# Altium schematic sheet 底板20160428.SchDoc
size A1
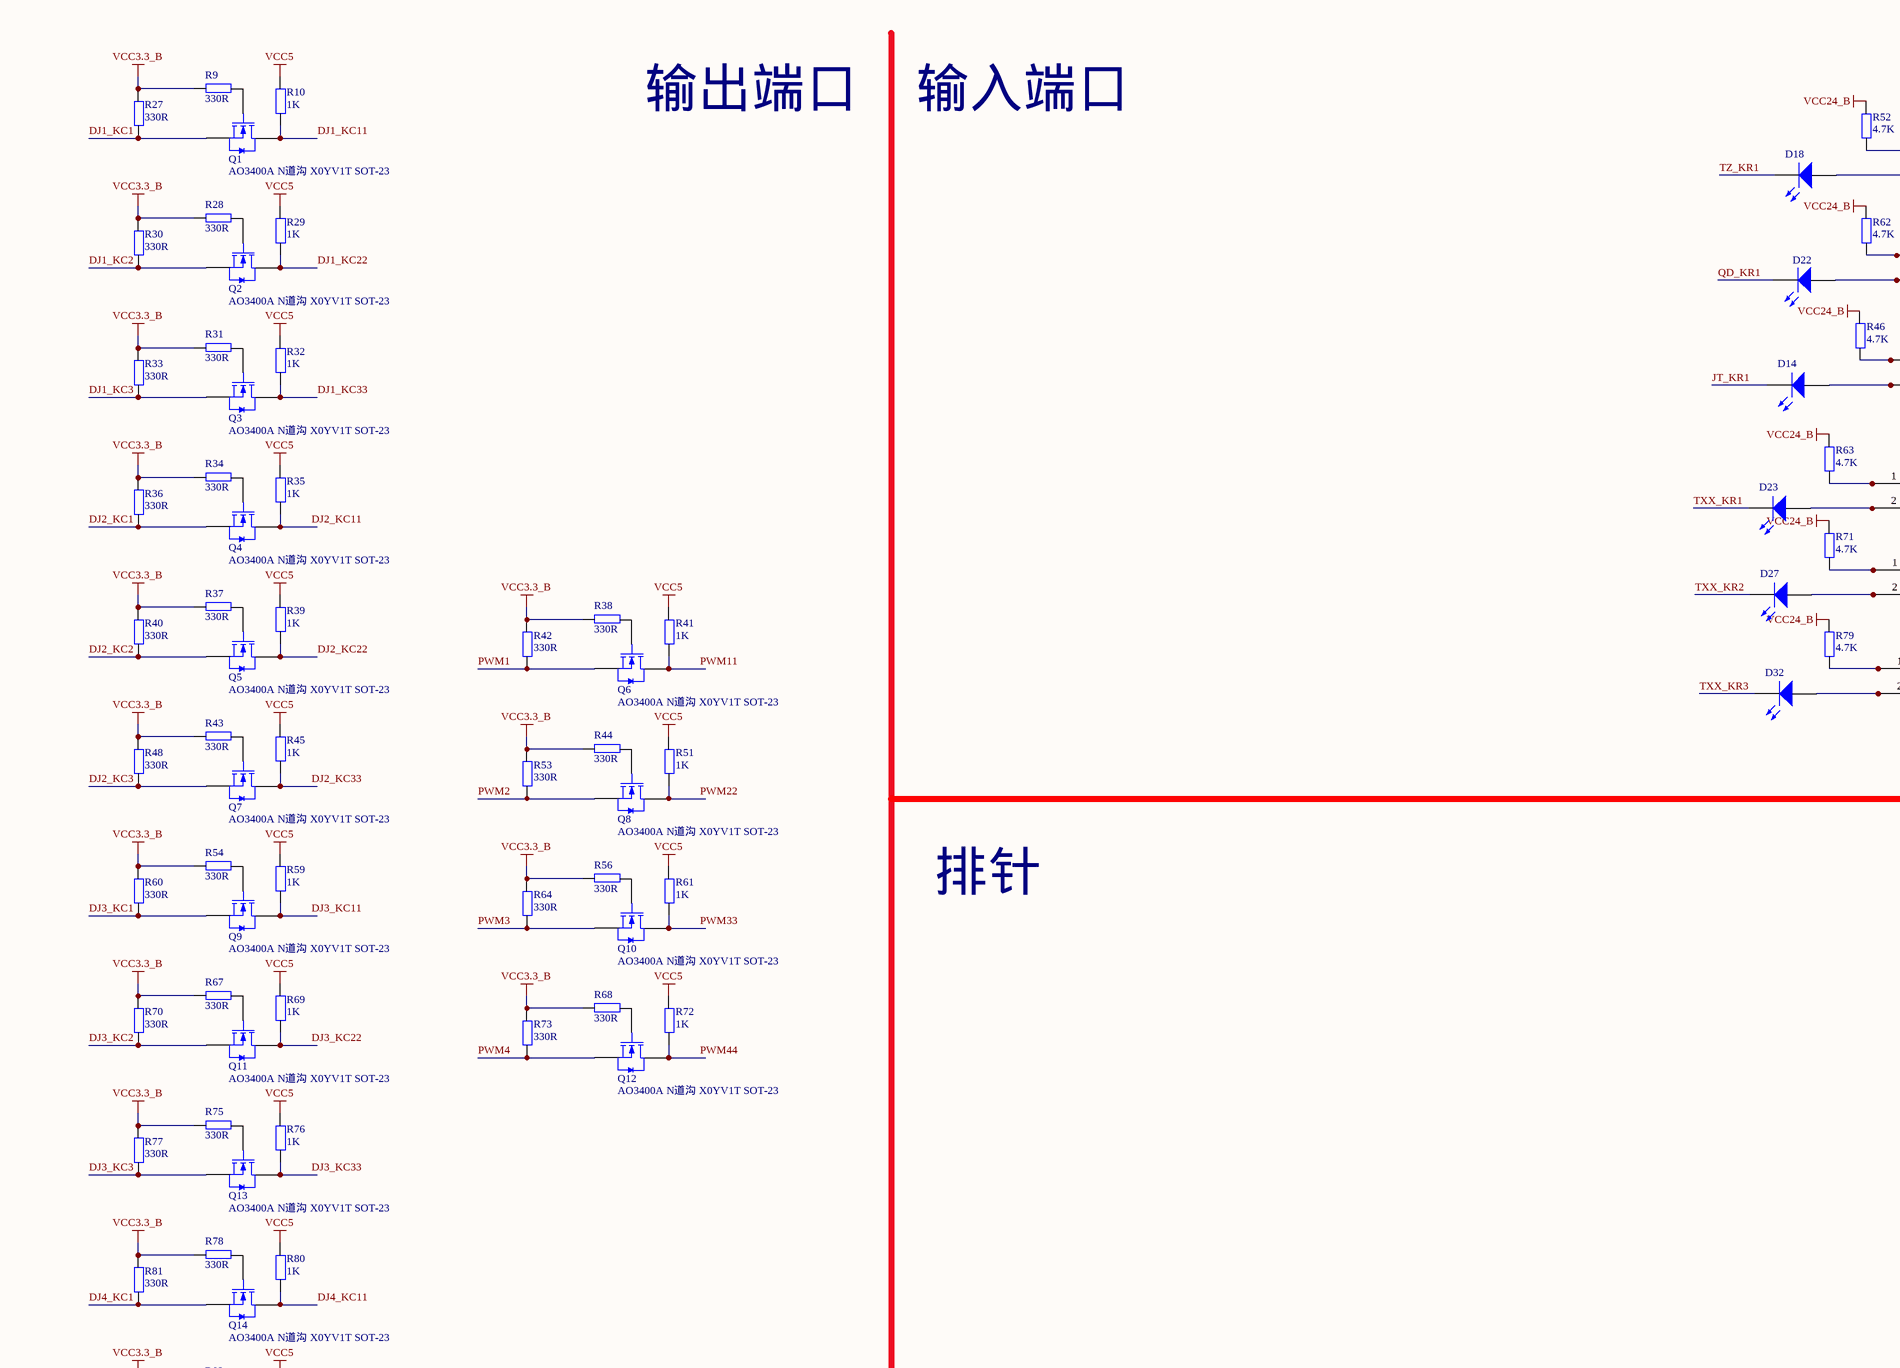
[diagram p0: 底板20160428.SchDoc, top left]
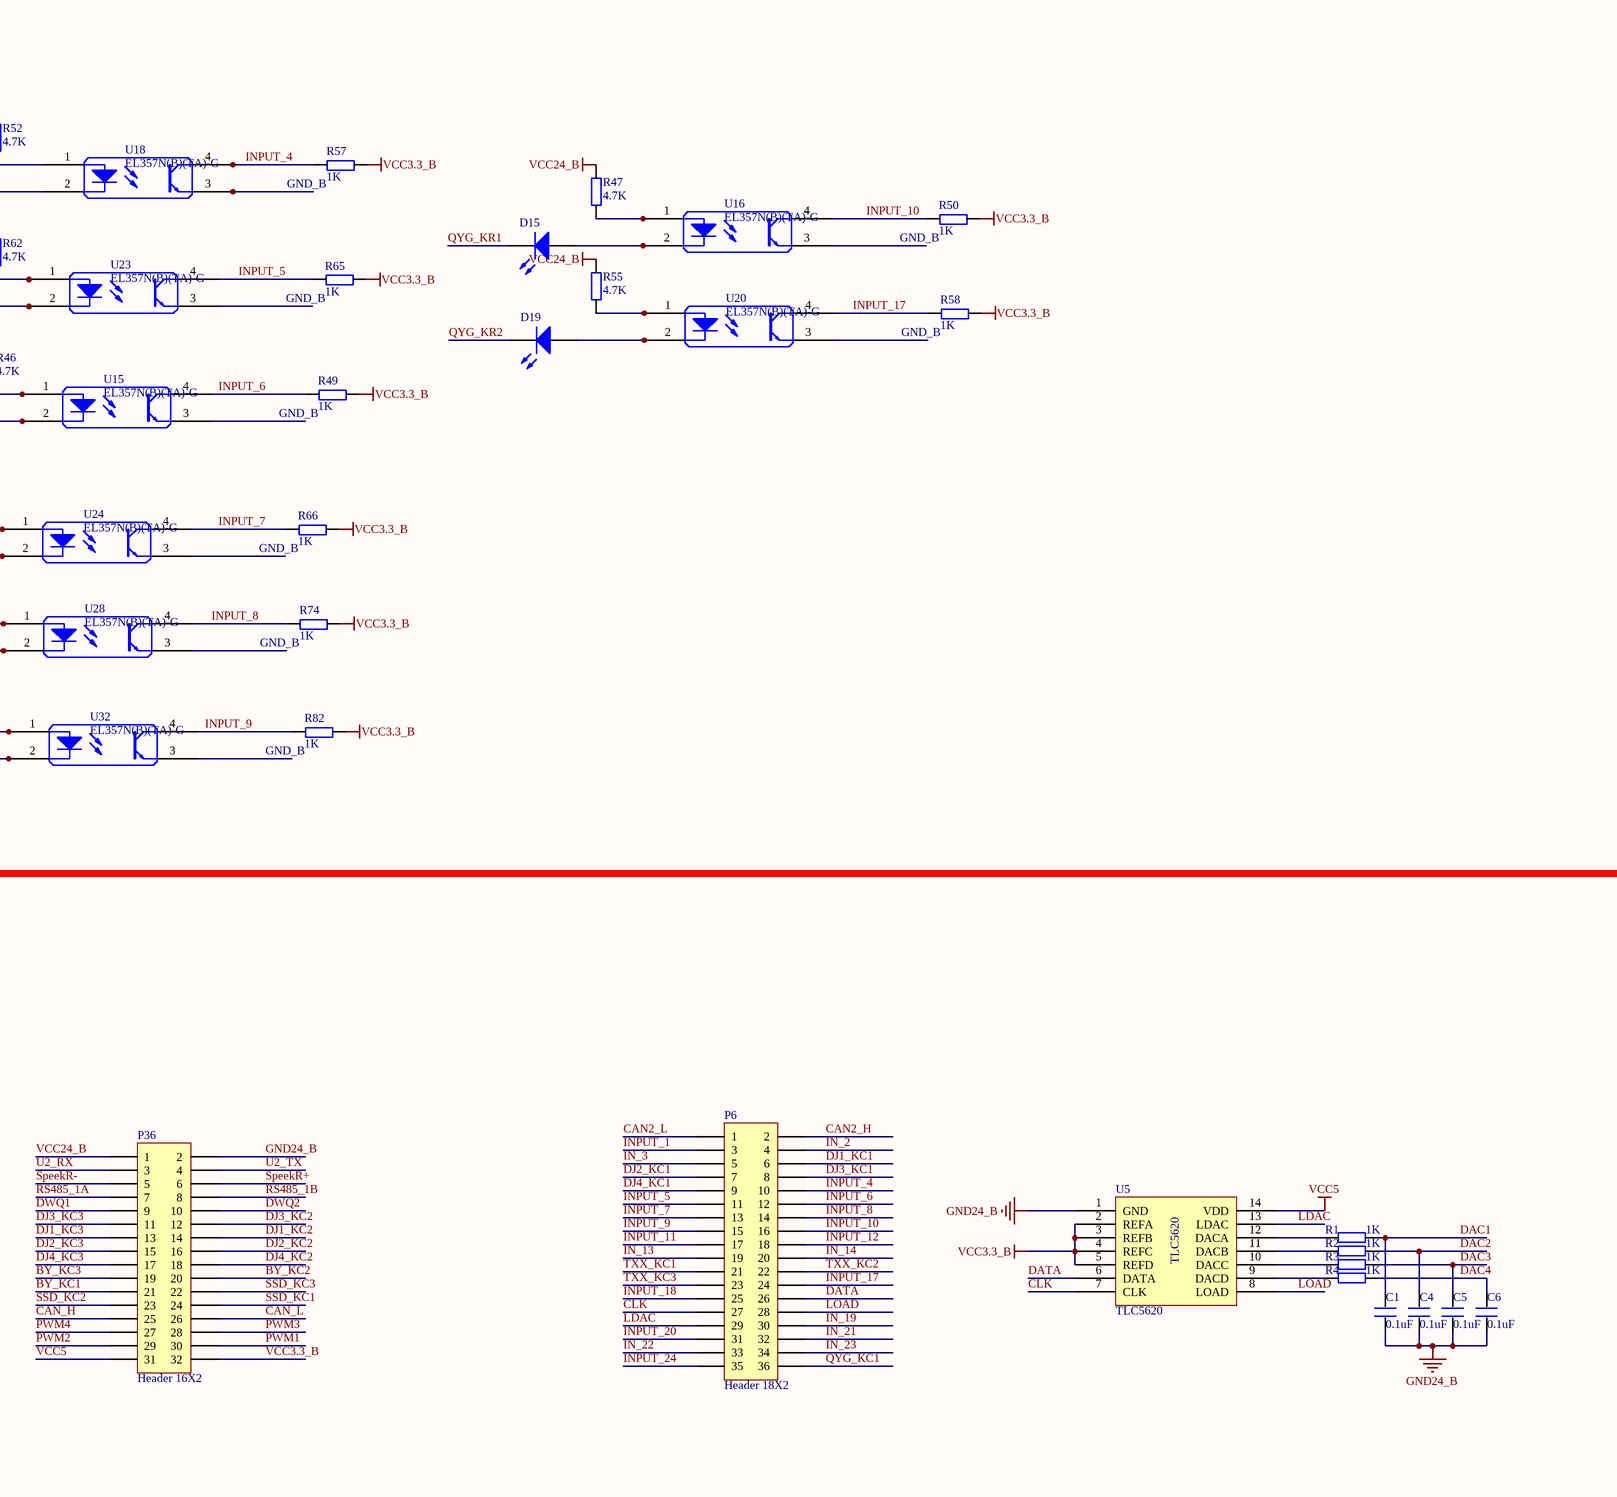
[diagram p1: 底板20160428.SchDoc, top right]
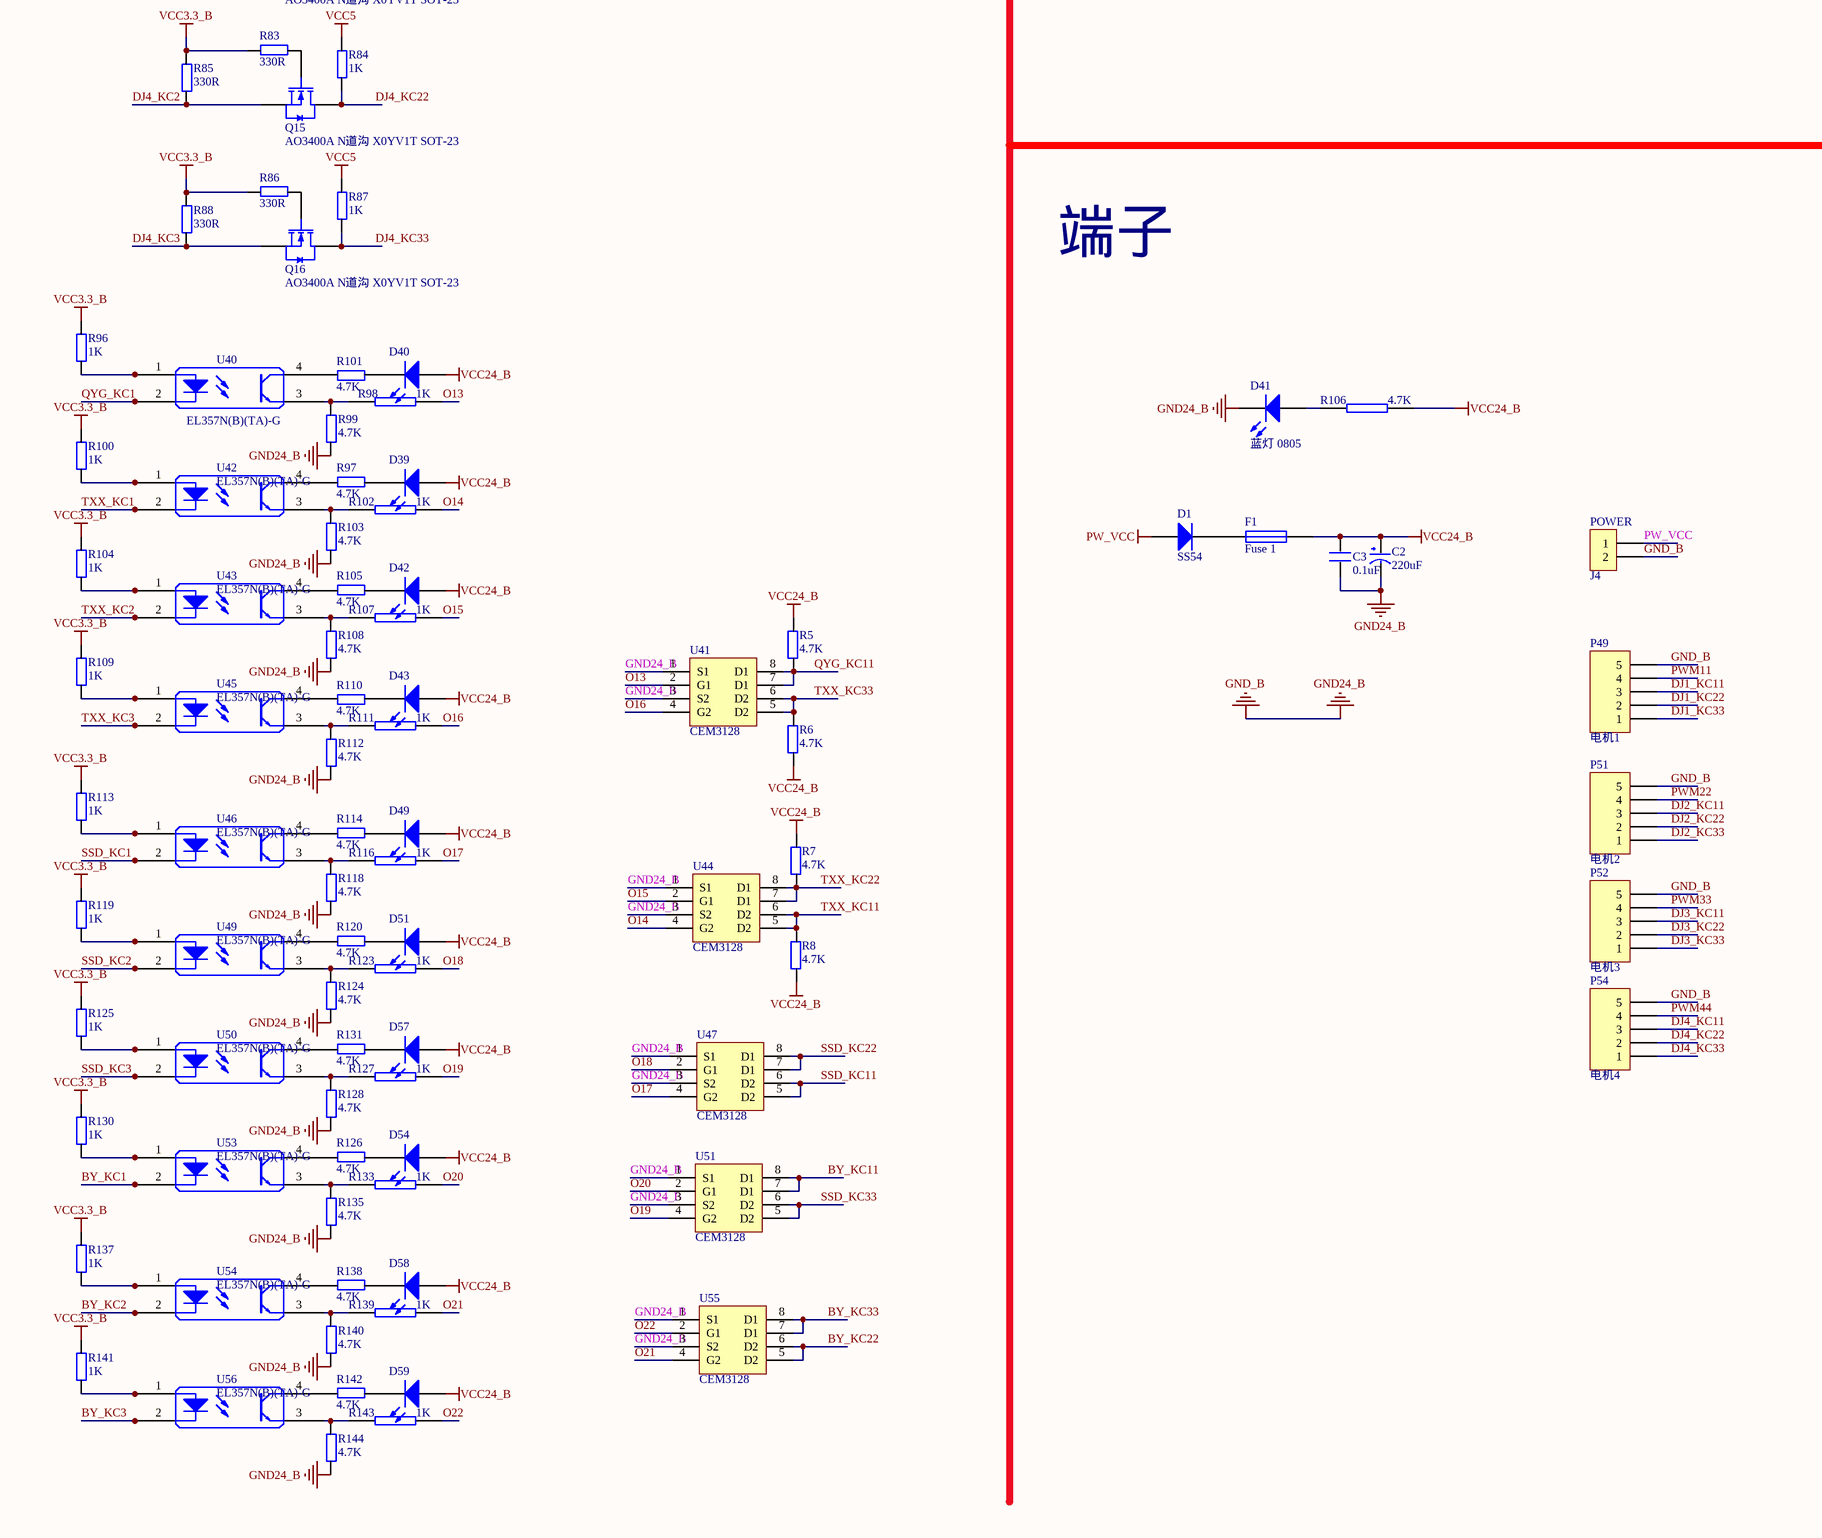
[diagram p2: 底板20160428.SchDoc, bottom left]
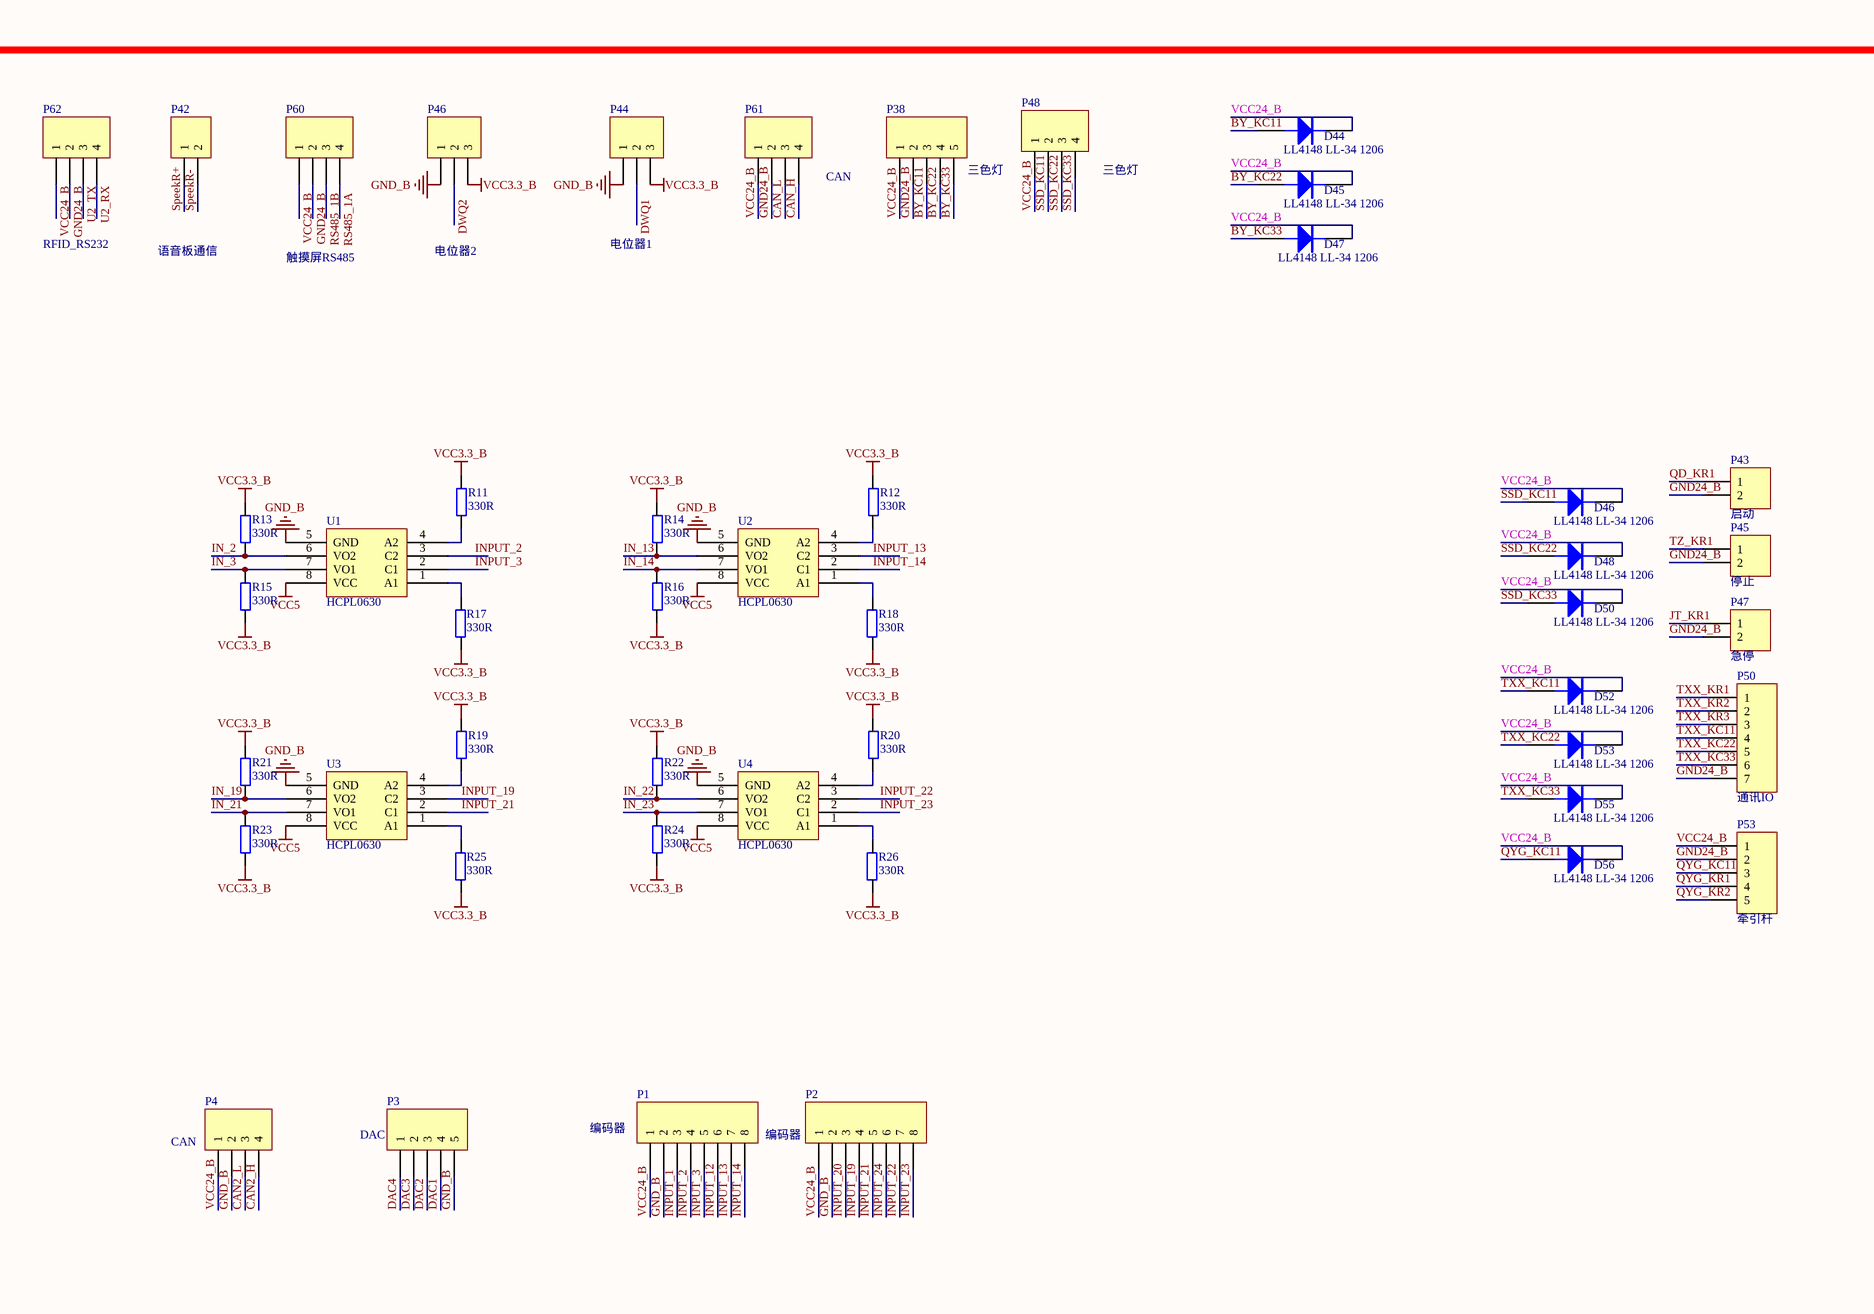
[diagram p3: 底板20160428.SchDoc, bottom right]

## Parts
C1  0.1uF  [0603]
C2  220uF  [CC6.56.5]
C3  0.1uF  [0805]
C4  0.1uF  [0603]
C5  0.1uF  [0603]
C6  0.1uF  [0603]
D1  SS54  [SMA(DO-214AC)_S1]
D14  红灯 0805  [LC-0805_LED_S1]  (value not drawn)
D15  红灯 0805  [LC-0805_LED_S1]  (value not drawn)
D18  红灯 0805  [LC-0805_LED_S1]  (value not drawn)
D19  红灯 0805  [LC-0805_LED_S1]  (value not drawn)
D22  红灯 0805  [LC-0805_LED_S1]  (value not drawn)
D23  红灯 0805  [LC-0805_LED_S1]  (value not drawn)
D27  红灯 0805  [LC-0805_LED_S1]  (value not drawn)
D32  红灯 0805  [LC-0805_LED_S1]  (value not drawn)
D39  红灯 0805  [LC-0805_LED_S1]  (value not drawn)
D40  红灯 0805  [LC-0805_LED_S1]  (value not drawn)
D41  蓝灯 0805  [0805_LED_S1]
D42  红灯 0805  [LC-0805_LED_S1]  (value not drawn)
D43  红灯 0805  [LC-0805_LED_S1]  (value not drawn)
D44  LL4148 LL-34 1206  [LC-LL-34]
D45  LL4148 LL-34 1206  [LC-LL-34]
D46  LL4148 LL-34 1206  [LC-LL-34]
D47  LL4148 LL-34 1206  [LC-LL-34]
D48  LL4148 LL-34 1206  [LC-LL-34]
D49  红灯 0805  [LC-0805_LED_S1]  (value not drawn)
D50  LL4148 LL-34 1206  [LC-LL-34]
D51  红灯 0805  [LC-0805_LED_S1]  (value not drawn)
D52  LL4148 LL-34 1206  [LC-LL-34]
D53  LL4148 LL-34 1206  [LC-LL-34]
D54  红灯 0805  [LC-0805_LED_S1]  (value not drawn)
D55  LL4148 LL-34 1206  [LC-LL-34]
D56  LL4148 LL-34 1206  [LC-LL-34]
D57  红灯 0805  [LC-0805_LED_S1]  (value not drawn)
D58  红灯 0805  [LC-0805_LED_S1]  (value not drawn)
D59  红灯 0805  [LC-0805_LED_S1]  (value not drawn)
F1  Fuse 1  [1206]
J4  CON2  [DZ-2-3.5]  (value not drawn)
P1  编码器  [DZ-8-3.5]
P2  编码器  [DZ-8-3.5]
P3  DAC  [DZ-5-3.5]
P4  CAN  [DZ-4-3.5]
P6  Header 18X2  [HDR2X18]
P36  Header 16X2  [HDR2X16]
P38  三色灯  [DZ-5-3.5]
P42  语音板通信  [DZ-2-3.5]
P43  启动  [DZ-2-3.5]
P44  电位器1  [DZ-3-3.5]
P45  停止  [DZ-2-3.5]
P46  电位器2  [DZ-3-3.5]
P47  急停  [DZ-2-3.5]
P48  三色灯  [DZ-4-3.5]
P49  电机1  [DZ-5-3.5]
P50  通讯IO  [DZ-7-3.5]
P51  电机2  [DZ-5-3.5]
P52  电机3  [DZ-5-3.5]
P53  牵引杆  [DZ-5-3.5]
P54  电机4  [DZ-5-3.5]
P60  触摸屏RS485  [DZ-4-3.5]
P61  CAN  [DZ-4-3.5]
P62  RFID_RS232  [DZ-4-3.5]
Q1  AO3400A N道沟 X0YV1T SOT-23  [SOT-23-3L]
Q2  AO3400A N道沟 X0YV1T SOT-23  [SOT-23-3L]
Q3  AO3400A N道沟 X0YV1T SOT-23  [SOT-23-3L]
Q4  AO3400A N道沟 X0YV1T SOT-23  [SOT-23-3L]
Q5  AO3400A N道沟 X0YV1T SOT-23  [SOT-23-3L]
Q6  AO3400A N道沟 X0YV1T SOT-23  [SOT-23-3L]
Q7  AO3400A N道沟 X0YV1T SOT-23  [SOT-23-3L]
Q8  AO3400A N道沟 X0YV1T SOT-23  [SOT-23-3L]
Q9  AO3400A N道沟 X0YV1T SOT-23  [SOT-23-3L]
Q10  AO3400A N道沟 X0YV1T SOT-23  [SOT-23-3L]
Q11  AO3400A N道沟 X0YV1T SOT-23  [SOT-23-3L]
Q12  AO3400A N道沟 X0YV1T SOT-23  [SOT-23-3L]
Q13  AO3400A N道沟 X0YV1T SOT-23  [SOT-23-3L]
Q14  AO3400A N道沟 X0YV1T SOT-23  [SOT-23-3L]
Q15  AO3400A N道沟 X0YV1T SOT-23  [SOT-23-3L]
Q16  AO3400A N道沟 X0YV1T SOT-23  [SOT-23-3L]
R1  1K  [0603]
R2  1K  [0603]
R3  1K  [0603]
R4  1K  [0603]
R5  4.7K  [0603]
R6  4.7K  [0603]
R7  4.7K  [0603]
R8  4.7K  [0603]
R9  330R  [0603]
R10  1K  [0603]
R11  330R  [0603]
R12  330R  [0603]
R13  330R  [0603]
R14  330R  [0603]
R15  330R  [0603]
R16  330R  [0603]
R17  330R  [0603]
R18  330R  [0603]
R19  330R  [0603]
R20  330R  [0603]
R21  330R  [0603]
R22  330R  [0603]
R23  330R  [0603]
R24  330R  [0603]
R25  330R  [0603]
R26  330R  [0603]
R27  330R  [0603]
R28  330R  [0603]
R29  1K  [0603]
R30  330R  [0603]
R31  330R  [0603]
R32  1K  [0603]
R33  330R  [0603]
R34  330R  [0603]
R35  1K  [0603]
R36  330R  [0603]
R37  330R  [0603]
R38  330R  [0603]
R39  1K  [0603]
R40  330R  [0603]
R41  1K  [0603]
R42  330R  [0603]
R43  330R  [0603]
R44  330R  [0603]
R45  1K  [0603]
R46  4.7K  [0603]
R47  4.7K  [0603]
R48  330R  [0603]
R49  1K  [0603]
R50  1K  [0603]
R51  1K  [0603]
R52  4.7K  [0603]
R53  330R  [0603]
R54  330R  [0603]
R55  4.7K  [0603]
R56  330R  [0603]
R57  1K  [0603]
R58  1K  [0603]
R59  1K  [0603]
R60  330R  [0603]
R61  1K  [0603]
R62  4.7K  [0603]
R63  4.7K  [0603]
R64  330R  [0603]
R65  1K  [0603]
R66  1K  [0603]
R67  330R  [0603]
R68  330R  [0603]
R69  1K  [0603]
R70  330R  [0603]
R71  4.7K  [0603]
R72  1K  [0603]
R73  330R  [0603]
R74  1K  [0603]
R75  330R  [0603]
R76  1K  [0603]
R77  330R  [0603]
R78  330R  [0603]
R79  4.7K  [0603]
R80  1K  [0603]
R81  330R  [0603]
R82  1K  [0603]
R83  330R  [0603]
R84  1K  [0603]
R85  330R  [0603]
R86  330R  [0603]
R87  1K  [0603]
R88  330R  [0603]
R96  1K  [0603]
R97  4.7K  [0603]
R98  1K  [0603]
R99  4.7K  [0603]
R100  1K  [0603]
R101  4.7K  [0603]
R102  1K  [0603]
R103  4.7K  [0603]
R104  1K  [0603]
R105  4.7K  [0603]
R106  4.7K  [0603]
R107  1K  [0603]
R108  4.7K  [0603]
R109  1K  [0603]
R110  4.7K  [0603]
R111  1K  [0603]
R112  4.7K  [0603]
R113  1K  [0603]
R114  4.7K  [0603]
R116  1K  [0603]
R118  4.7K  [0603]
R119  1K  [0603]
R120  4.7K  [0603]
R123  1K  [0603]
R124  4.7K  [0603]
R125  1K  [0603]
R126  4.7K  [0603]
R127  1K  [0603]
R128  4.7K  [0603]
R130  1K  [0603]
R131  4.7K  [0603]
R133  1K  [0603]
R135  4.7K  [0603]
R137  1K  [0603]
R138  4.7K  [0603]
R139  1K  [0603]
R140  4.7K  [0603]
R141  1K  [0603]
R142  4.7K  [0603]
R143  1K  [0603]
R144  4.7K  [0603]
U1  HCPL0630  [SO-8]
U2  HCPL0630  [SO-8]
U3  HCPL0630  [SO-8]
U4  HCPL0630  [SO-8]
U5  TLC5620  [LC-SOIC-14_150mil]
U15  EL357N(B)(TA)-G  [LC-SOP-4_P2.54]
U16  EL357N(B)(TA)-G  [LC-SOP-4_P2.54]
U18  EL357N(B)(TA)-G  [LC-SOP-4_P2.54]
U20  EL357N(B)(TA)-G  [LC-SOP-4_P2.54]
U23  EL357N(B)(TA)-G  [LC-SOP-4_P2.54]
U24  EL357N(B)(TA)-G  [LC-SOP-4_P2.54]
U28  EL357N(B)(TA)-G  [LC-SOP-4_P2.54]
U32  EL357N(B)(TA)-G  [LC-SOP-4_P2.54]
U40  EL357N(B)(TA)-G  [LC-SOP-4_P2.54]
U41  CEM3128  [SO-8]
U42  EL357N(B)(TA)-G  [LC-SOP-4_P2.54]
U43  EL357N(B)(TA)-G  [LC-SOP-4_P2.54]
U44  CEM3128  [SO-8]
U45  EL357N(B)(TA)-G  [LC-SOP-4_P2.54]
U46  EL357N(B)(TA)-G  [LC-SOP-4_P2.54]
U47  CEM3128  [SO-8]
U49  EL357N(B)(TA)-G  [LC-SOP-4_P2.54]
U50  EL357N(B)(TA)-G  [LC-SOP-4_P2.54]
U51  CEM3128  [SO-8]
U53  EL357N(B)(TA)-G  [LC-SOP-4_P2.54]
U54  EL357N(B)(TA)-G  [LC-SOP-4_P2.54]
U55  CEM3128  [SO-8]
U56  EL357N(B)(TA)-G  [LC-SOP-4_P2.54]

## Nets
GND24_B: C1.1 C2.2(GND) C3.2 C4.1 C5.1 C6.1 D41.K J4.2 P1.2 P2.2 P3.5 P4.2 P36.2 P38.2 P43.2 P44.1 P45.2 P46.1 P47.2 P49.5 P50.7 P51.5 P52.5 P53.2 P54.5 P60.2 P61.2 P62.2 R99.1 R103.1 R108.1 R112.1 R118.1 R124.1 R128.1 R135.1 R140.1 R144.1 U1.5(GND) U2.5(GND) U3.5(GND) U4.5(GND) U5.1(GND) U15.3 U16.3 U18.3 U20.3 U23.3 U24.3 U28.3 U32.3 U41.1(S1) U41.3(S2) U44.1(S1) U44.3(S2) U47.1(S1) U47.3(S2) U51.1(S1) U51.3(S2) U55.1(S1) U55.3(S2)  [also labelled GND_B]
PW_VCC: D1.1(A) J4.1
VCC3.3_B: P36.32 P44.3 P46.3 R9.2 R11.2 R12.2 R13.2 R14.2 R15.1 R16.1 R17.2 R18.2 R19.2 R20.2 R21.2 R22.2 R23.1 R24.1 R25.2 R26.2 R27.2 R28.2 R30.2 R31.2 R33.2 R34.2 R36.2 R37.2 R38.2 R40.2 R42.2 R43.2 R44.2 R48.2 R49.2 R50.2 R53.2 R54.2 R56.2 R57.2 R58.2 R60.2 R64.2 R65.2 R66.2 R67.2 R68.2 R70.2 R73.2 R74.2 R75.2 R77.2 R78.2 R81.2 R82.2 R83.2 R85.2 R86.2 R88.2 R96.2 R100.2 R104.2 R109.2 R113.2 R119.2 R125.2 R130.2 R137.2 R141.2 U5.2(REFA) U5.3(REFB) U5.4(REFC) U5.5(REFD)
VCC5: P36.31 R10.2 R29.2 R32.2 R35.2 R39.2 R41.2 R45.2 R51.2 R59.2 R61.2 R69.2 R72.2 R76.2 R80.2 R84.2 R87.2 U1.8(VCC) U2.8(VCC) U3.8(VCC) U4.8(VCC) U5.14(VDD)
VCC24_B: C2.1(VCC) C3.1 D39.A D40.A D42.A D43.A D44.2(K) D45.2(K) D46.2(K) D47.2(K) D48.2(K) D49.A D50.2(K) D51.A D52.2(K) D53.2(K) D54.A D55.2(K) D56.2(K) D57.A D58.A D59.A F1.2 P1.1 P2.1 P4.1 P36.1 P38.1 P48.1 P53.1 P60.1 P61.1 P62.1 R5.1 R6.2 R7.1 R8.2 R46.2 R47.2 R52.2 R55.2 R62.2 R63.2 R71.2 R79.2 R106.1
BY_KC1: P36.21 U53.2
BY_KC2: P36.20 U54.2
BY_KC3: P36.19 U56.2
BY_KC11: D44.1(A) P38.3 U51.7(D1) U51.8(D1)
BY_KC22: D45.1(A) P38.4 U55.5(D2) U55.6(D2)
BY_KC33: D47.1(A) P38.5 U55.7(D1) U55.8(D1)
CAN2_H: P4.4 P6.2
CAN2_L: P4.3 P6.1
CAN_H: P36.25 P61.4
CAN_L: P36.26 P61.3
CLK: P6.27 U5.7(CLK)
DAC1: C1.2 P3.4 R1.1
DAC2: C4.2 P3.3 R2.1
DAC3: C5.2 P3.2 R3.1
DAC4: C6.2 P3.1 R4.1
DATA: P6.26 U5.6(DATA)
DJ1_KC1: P6.6 Q1.2(S) R27.1
DJ1_KC2: P36.14 Q2.2(S) R30.1
DJ1_KC3: P36.13 Q3.2(S) R33.1
DJ1_KC11: P49.3 Q1.3(D) R10.1
DJ1_KC22: P49.2 Q2.3(D) R29.1
DJ1_KC33: P49.1 Q3.3(D) R32.1
DJ2_KC1: P6.7 Q4.2(S) R36.1
DJ2_KC2: P36.16 Q5.2(S) R40.1
DJ2_KC3: P36.15 Q7.2(S) R48.1
DJ2_KC11: P51.3 Q4.3(D) R35.1
DJ2_KC22: P51.2 Q5.3(D) R39.1
DJ2_KC33: P51.1 Q7.3(D) R45.1
DJ3_KC1: P6.8 Q9.2(S) R60.1
DJ3_KC2: P36.12 Q11.2(S) R70.1
DJ3_KC3: P36.11 Q13.2(S) R77.1
DJ3_KC11: P52.3 Q9.3(D) R59.1
DJ3_KC22: P52.2 Q11.3(D) R69.1
DJ3_KC33: P52.1 Q13.3(D) R76.1
DJ4_KC1: P6.9 Q14.2(S) R81.1
DJ4_KC2: P36.18 Q15.2(S) R85.1
DJ4_KC3: P36.17 Q16.2(S) R88.1
DJ4_KC11: P54.3 Q14.3(D) R80.1
DJ4_KC22: P54.2 Q15.3(D) R84.1
DJ4_KC33: P54.1 Q16.3(D) R87.1
DWQ1: P36.9 P44.2
DWQ2: P36.10 P46.2
IN_2: P6.4 R13.1 U1.6(VO2)
IN_3: P6.5 R15.2 U1.7(VO1)
IN_13: P6.19 R14.1 U2.6(VO2)
IN_14: P6.20 R16.2 U2.7(VO1)
IN_19: P6.30 R21.1 U3.6(VO2)
IN_21: P6.32 R23.2 U3.7(VO1)
IN_22: P6.33 R22.1 U4.6(VO2)
IN_23: P6.34 R24.2 U4.7(VO1)
INPUT_1: P1.3 P6.3
INPUT_2: P1.4 U1.3(C2)
INPUT_3: P1.5 U1.2(C1)
INPUT_4: P6.10 R57.1 U18.4
INPUT_5: P6.11 R65.1 U23.4
INPUT_6: P6.12 R49.1 U15.4
INPUT_7: P6.13 R66.1 U24.4
INPUT_8: P6.14 R74.1 U28.4
INPUT_9: P6.15 R82.1 U32.4
INPUT_10: P6.16 R50.1 U16.4
INPUT_11: P6.17
INPUT_12: P1.6 P6.18
INPUT_13: P1.7 U2.3(C2)
INPUT_14: P1.8 U2.2(C1)
INPUT_17: P6.24 R58.1 U20.4
INPUT_18: P6.25
INPUT_19: P2.4 U3.3(C2)
INPUT_20: P2.3 P6.31
INPUT_21: P2.5 U3.2(C1)
INPUT_22: P2.7 U4.3(C2)
INPUT_23: P2.8 U4.2(C1)
INPUT_24: P2.6 P6.35
JT_KR1: D14.K P47.1
LDAC: P6.29 U5.13(LDAC)
LOAD: P6.28 U5.8(LOAD)
O13: R98.1 U41.2(G1)
O14: R102.1 U44.4(G2)
O15: R107.1 U44.2(G1)
O16: R111.1 U41.4(G2)
O17: R116.1 U47.4(G2)
O18: R123.1 U47.2(G1)
O19: R127.1 U51.4(G2)
O20: R133.1 U51.2(G1)
O21: R139.1 U55.4(G2)
O22: R143.1 U55.2(G1)
PWM1: P36.30 Q6.2(S) R42.1
PWM2: P36.29 Q8.2(S) R53.1
PWM3: P36.28 Q10.2(S) R64.1
PWM4: P36.27 Q12.2(S) R73.1
PWM11: P49.4 Q6.3(D) R41.1
PWM22: P51.4 Q8.3(D) R51.1
PWM33: P52.4 Q10.3(D) R61.1
PWM44: P54.4 Q12.3(D) R72.1
QD_KR1: D22.K P43.1
QYG_KC1: P6.36 U40.2
QYG_KC11: D56.1(A) P53.3 R5.2 U41.7(D1) U41.8(D1)
QYG_KR1: D15.K P53.4
QYG_KR2: D19.K P53.5
RS485_1A: P36.7 P60.4
RS485_1B: P36.8 P60.3
SpeekR+: P36.6 P42.1
SpeekR-: P36.5 P42.2
SSD_KC1: P36.24 U46.2
SSD_KC2: P36.23 U49.2
SSD_KC3: P36.22 U50.2
SSD_KC11: D46.1(A) P48.2 U47.5(D2) U47.6(D2)
SSD_KC22: D48.1(A) P48.3 U47.7(D1) U47.8(D1)
SSD_KC33: D50.1(A) P48.4 U51.5(D2) U51.6(D2)
TXX_KC1: P6.21 U42.2
TXX_KC2: P6.22 U43.2
TXX_KC3: P6.23 U45.2
TXX_KC11: D52.1(A) P50.4 R8.1 U44.5(D2) U44.6(D2)
TXX_KC22: D53.1(A) P50.5 R7.2 U44.7(D1) U44.8(D1)
TXX_KC33: D55.1(A) P50.6 R6.1 U41.5(D2) U41.6(D2)
TXX_KR1: D23.K P50.1
TXX_KR2: D27.K P50.2
TXX_KR3: D32.K P50.3
TZ_KR1: D18.K P45.1
U2_RX: P36.3 P62.4
U2_TX: P36.4 P62.3
NetD1_2: D1.2(K) F1.1
NetD14_A: D14.A U15.2
NetD15_A: D15.A U16.2
NetD18_A: D18.A U18.2
NetD19_A: D19.A U20.2
NetD22_A: D22.A U23.2
NetD23_A: D23.A U24.2
NetD27_A: D27.A U28.2
NetD32_A: D32.A U32.2
NetD39_K: D39.K R97.1
NetD40_K: D40.K R101.2
NetD41_A: D41.A R106.2
NetD42_K: D42.K R105.1
NetD43_K: D43.K R110.2
NetD49_K: D49.K R114.1
NetD51_K: D51.K R120.1
NetD54_K: D54.K R126.1
NetD57_K: D57.K R131.1
NetD58_K: D58.K R138.1
NetD59_K: D59.K R142.1
NetQ1_1: Q1.1(G) R9.1
NetQ2_1: Q2.1(G) R28.1
NetQ3_1: Q3.1(G) R31.1
NetQ4_1: Q4.1(G) R34.1
NetQ5_1: Q5.1(G) R37.1
NetQ6_1: Q6.1(G) R38.1
NetQ7_1: Q7.1(G) R43.1
NetQ8_1: Q8.1(G) R44.1
NetQ9_1: Q9.1(G) R54.1
NetQ10_1: Q10.1(G) R56.1
NetQ11_1: Q11.1(G) R67.1
NetQ12_1: Q12.1(G) R68.1
NetQ13_1: Q13.1(G) R75.1
NetQ14_1: Q14.1(G) R78.1
NetQ15_1: Q15.1(G) R83.1
NetQ16_1: Q16.1(G) R86.1
NetR1_2: R1.2 U5.12(DACA)
NetR2_2: R2.2 U5.11(DACB)
NetR3_2: R3.2 U5.10(DACC)
NetR4_2: R4.2 U5.9(DACD)
NetR11_1: R11.1 U1.4(A2)
NetR12_1: R12.1 U2.4(A2)
NetR17_1: R17.1 U1.1(A1)
NetR18_1: R18.1 U2.1(A1)
NetR19_1: R19.1 U3.4(A2)
NetR20_1: R20.1 U4.4(A2)
NetR25_1: R25.1 U3.1(A1)
NetR26_1: R26.1 U4.1(A1)
NetR46_1: R46.1 U15.1
NetR47_1: R47.1 U16.1
NetR52_1: R52.1 U18.1
NetR55_1: R55.1 U20.1
NetR62_1: R62.1 U23.1
NetR63_1: R63.1 U24.1
NetR71_1: R71.1 U28.1
NetR79_1: R79.1 U32.1
NetR96_1: R96.1 U40.1
NetR97_2: R97.2 U42.4
NetR98_2: R98.2 R99.2 U40.3
NetR100_1: R100.1 U42.1
NetR101_1: R101.1 U40.4
NetR102_2: R102.2 R103.2 U42.3
NetR104_1: R104.1 U43.1
NetR105_2: R105.2 U43.4
NetR107_2: R107.2 R108.2 U43.3
NetR109_1: R109.1 U45.1
NetR110_1: R110.1 U45.4
NetR111_2: R111.2 R112.2 U45.3
NetR113_1: R113.1 U46.1
NetR114_2: R114.2 U46.4
NetR116_2: R116.2 R118.2 U46.3
NetR119_1: R119.1 U49.1
NetR120_2: R120.2 U49.4
NetR123_2: R123.2 R124.2 U49.3
NetR125_1: R125.1 U50.1
NetR126_2: R126.2 U53.4
NetR127_2: R127.2 R128.2 U50.3
NetR130_1: R130.1 U53.1
NetR131_2: R131.2 U50.4
NetR133_2: R133.2 R135.2 U53.3
NetR137_1: R137.1 U54.1
NetR138_2: R138.2 U54.4
NetR139_2: R139.2 R140.2 U54.3
NetR141_1: R141.1 U56.1
NetR142_2: R142.2 U56.4
NetR143_2: R143.2 R144.2 U56.3

## Notes on the sheet
- 输出端口
- 输入端口
- 排针
- 端子
- (near J4) POWER

## Library data of the parts
C1 C3-C6 = C
C2 = CAP
D1 = SMA(DO-214AC) SS54: 二极管; ComponentLink1Description: 供应商链接; ComponentLink1URL: http://www.szlcsc.com/product/details_23178.html; Package: SMA(DO-214AC); Supplier: LC; SuppliersPartNumber: C22452
D14 D15 D18 D19 D22 D23 D27 D32 D39 D40 D42 D43 D49 D51 D54 D57-D59 = LED0: Typical INFRARED GaAs LED; Published: 8-Jun-2000; LatestRevisionDate: 08-Jul-2005; LatestRevisionNote: Mech Layer 1 removed.; PackageReference: LED-0; Publisher: Altium Limited; PackageDescription: LED; 2 Leads
D41 = 0805 蓝灯: 发光二极管; ComponentLink1Description: 供应商链接; ComponentLink1URL: http://www.szlcsc.com/product/details_2666.html; Package: 0805; Supplier: LC; SuppliersPartNumber: C2293
D44-D48 D50 D52 D53 D55 D56 = DIODE
F1 = Fuse 1: Fuse; Published: 8-Jun-2000; LatestRevisionDate: 17-Jul-2002; LatestRevisionNote: Re-released for DXP Platform.; PackageReference: PIN-W2/E2.8; Publisher: Altium Limited; PackageDescription: Thru-Hole; 2 Leads
J4 = CON2: Connector
P1 P2 = Header 8: Header, 8-Pin; LatestRevisionDate: 17-Jul-2002; LatestRevisionNote: Re-released for DXP Platform.; Publisher: Altium Limited
P3 P38 P49 P51-P54 = Header 5: Header, 5-Pin; LatestRevisionDate: 17-Jul-2002; LatestRevisionNote: Re-released for DXP Platform.; Publisher: Altium Limited
P4 P48 P60-P62 = Header 4: Header, 4-Pin; LatestRevisionDate: 17-Jul-2002; LatestRevisionNote: Re-released for DXP Platform.; Publisher: Altium Limited
P6 = Header 18X2: Header, 18-Pin, Dual row; LatestRevisionDate: 17-Jul-2002; LatestRevisionNote: Re-released for DXP Platform.; Publisher: Altium Limited
P36 = Header 16X2: Header, 16-Pin, Dual row; LatestRevisionDate: 17-Jul-2002; LatestRevisionNote: Re-released for DXP Platform.; Publisher: Altium Limited
P42 P43 P45 P47 = Header 2: Header, 2-Pin; LatestRevisionDate: 17-Jul-2002; LatestRevisionNote: Re-released for DXP Platform.; Publisher: Altium Limited
P44 P46 = Header 3: Header, 3-Pin; LatestRevisionDate: 17-Jul-2002; LatestRevisionNote: Re-released for DXP Platform.; Publisher: Altium Limited
P50 = Header 7: Header, 7-Pin; LatestRevisionDate: 17-Jul-2002; LatestRevisionNote: Re-released for DXP Platform.; Publisher: Altium Limited
Q1-Q16 = AO3400A N道沟 X0YV1T SOT-23: MOS(场效应管); ComponentLink1Description: 供应商链接; ComponentLink1URL: http://www.szlcsc.com/product/details_21629.html; Package: SOT-23; Supplier: LC; SuppliersPartNumber: C20917
R1-R88 R96 R97 R99-R101 R103-R105 R108-R110 R112-R114 R118-R120 R124-R126 R128 R130 R131 R135 R137 R138 R140-R142 R144 = R_2
R98 R102 R106 R107 R111 R116 R123 R127 R133 R139 R143 = RES2
U5 = Component_1
U15 U16 U18 U20 U23 U24 U28 U32 U40 U42 U43 U45 U46 U49 U50 U53 U54 U56 = 2701
U41 U44 U47 U51 U55 = AF4920N